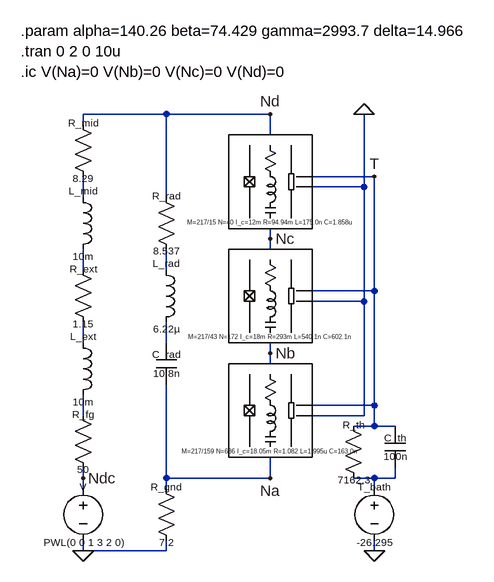
[diagram p0: schematic JPE_3stacks.asc]
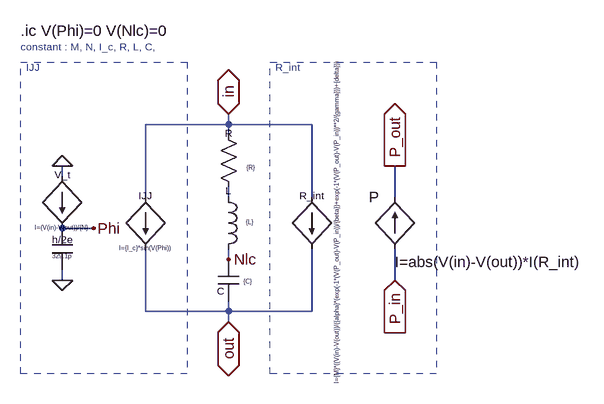
[diagram p1: sub-circuit 1stack.asc]
JPE_3stacks.asc, the LTspice schematic file:
Version 4
SHEET 1 1820 680
WIRE 544 -512 416 -512
WIRE 704 -512 544 -512
WIRE 416 -496 416 -512
WIRE 704 -480 704 -512
WIRE 864 -416 768 -416
WIRE 848 -400 848 -512
WIRE 848 -400 768 -400
WIRE 416 -384 416 -416
WIRE 544 -384 544 -512
WIRE 704 -320 704 -336
WIRE 704 -304 704 -320
WIRE 416 -272 416 -304
WIRE 544 -272 544 -304
WIRE 864 -240 864 -416
WIRE 864 -240 768 -240
WIRE 848 -224 848 -400
WIRE 848 -224 768 -224
WIRE 416 -160 416 -192
WIRE 544 -160 544 -192
WIRE 704 -144 704 -160
WIRE 704 -128 704 -144
WIRE 864 -64 864 -240
WIRE 864 -64 768 -64
WIRE 416 -48 416 -80
WIRE 848 -48 848 -224
WIRE 848 -48 768 -48
WIRE 864 -32 864 -64
WIRE 864 -32 832 -32
WIRE 896 -32 864 -32
WIRE 416 48 416 32
WIRE 544 48 544 -96
WIRE 704 48 704 16
WIRE 704 48 544 48
WIRE 864 48 832 48
WIRE 896 48 896 32
WIRE 896 48 864 48
WIRE 416 64 416 48
WIRE 544 64 544 48
WIRE 864 64 864 48
WIRE 416 160 416 144
WIRE 544 160 544 144
WIRE 544 160 416 160
WIRE 864 160 864 144
FLAG 416 160 0
FLAG 704 -144 Nb
FLAG 704 48 Na
FLAG 864 160 0
FLAG 864 -416 T
FLAG 848 -512 0
FLAG 704 -320 Nc
FLAG 704 -512 Nd
FLAG 416 48 Ndc
SYMBOL voltage 416 48 R0
WINDOW 0 0 24 Bottom 1
WINDOW 3 0 88 Top 1
SYMATTR InstName V
SYMATTR Value PWL(0 0 1 3 2 0)
SYMBOL res 400 -64 R0
WINDOW 0 16 24 Bottom 1
WINDOW 3 16 88 Top 1
SYMATTR InstName R_fg
SYMATTR Value 50
SYMBOL ind 400 -176 R0
WINDOW 0 16 16 Bottom 1
WINDOW 3 16 96 Top 1
SYMATTR InstName L_ext
SYMATTR Value 10m
SYMBOL res 400 -288 R0
WINDOW 0 16 24 Bottom 1
WINDOW 3 16 88 Top 1
SYMATTR InstName R_ext
SYMATTR Value 1.15
SYMBOL ind 400 -400 R0
WINDOW 0 16 16 Bottom 1
WINDOW 3 16 96 Top 1
SYMATTR InstName L_mid
SYMATTR Value 10m
SYMBOL ind 528 -288 R0
WINDOW 0 16 16 Bottom 1
WINDOW 3 16 96 Top 1
SYMATTR InstName L_rad
SYMATTR Value 6.22µ
SYMBOL res 528 -400 R0
WINDOW 0 16 24 Bottom 1
WINDOW 3 16 88 Top 1
SYMATTR InstName R_rad
SYMATTR Value 8.537
SYMBOL cap 528 -160 R0
WINDOW 0 16 28 Bottom 1
WINDOW 3 16 36 Top 1
SYMATTR InstName C_rad
SYMATTR Value 10.8n
SYMBOL res 528 48 R0
WINDOW 0 16 24 Bottom 1
WINDOW 3 16 88 Top 1
SYMATTR InstName R_gnd
SYMATTR Value 7.2
SYMBOL voltage 864 48 R0
WINDOW 0 0 24 Bottom 1
WINDOW 3 0 88 Top 1
SYMATTR InstName T_bath
SYMATTR Value -26.295
SYMBOL res 816 -48 R0
WINDOW 0 16 24 Bottom 1
WINDOW 3 16 88 Top 1
SYMATTR InstName R_th
SYMATTR Value 7162.3
SYMBOL cap 880 -32 R0
WINDOW 0 16 28 Bottom 1
WINDOW 3 16 36 Top 1
SYMATTR InstName C_th
SYMATTR Value 100n
SYMBOL res 400 -512 R0
WINDOW 0 16 24 Bottom 1
WINDOW 3 16 88 Top 1
SYMATTR InstName R_mid
SYMATTR Value 8.29
SYMBOL 1stack 704 -416 R0
WINDOW 0 0 -64 Invisible 1
WINDOW 39 0 64 Top 0
SYMATTR InstName X4
SYMATTR SpiceLine M=217/15 N=40 I_c=12m R=94.94m L=175.0n C=1.858u
SYMBOL 1stack 704 -240 R0
WINDOW 0 0 -64 Invisible 1
WINDOW 39 0 64 Top 0
SYMATTR InstName X5
SYMATTR SpiceLine M=217/43 N=172 I_c=18m R=293m L=540.1n C=602.1n
SYMBOL 1stack 704 -64 R0
WINDOW 0 0 -64 Invisible 1
WINDOW 39 0 64 Top 0
SYMATTR InstName X6
SYMATTR SpiceLine M=217/159 N=636 I_c=18.05m R=1.082 L=1.995u C=163.0n
TEXT 320 -640 Left 2 !.param alpha=140.26 beta=74.429 gamma=2993.7 delta=14.966\n.tran 0 2 0 10u\n.ic V(Na)=0 V(Nb)=0 V(Nc)=0 V(Nd)=0

1stack.asc, the sub-circuit schematic file:
Version 4
SHEET 1 880 680
WIRE 224 16 224 0
WIRE 224 16 96 16
WIRE 352 16 224 16
WIRE 224 32 224 16
WIRE -32 96 -32 80
WIRE 96 128 96 16
WIRE 224 128 224 112
WIRE 352 128 352 16
WIRE 480 128 480 80
WIRE 16 176 -32 176
WIRE 224 224 224 208
WIRE -32 256 -32 240
WIRE 480 256 480 208
WIRE 96 304 96 208
WIRE 224 304 224 288
WIRE 224 304 96 304
WIRE 352 304 352 208
WIRE 352 304 224 304
WIRE 224 320 224 304
FLAG 224 0 in
IOPIN 224 0 BiDir
FLAG 224 320 out
IOPIN 224 320 BiDir
FLAG 480 80 P_out
IOPIN 480 80 Out
FLAG 480 256 P_in
IOPIN 480 256 In
FLAG -32 80 0
FLAG -32 256 0
FLAG 16 176 Phi
FLAG 224 224 Nlc
SYMBOL bi 96 128 R0
WINDOW 0 0 8 Bottom 1
WINDOW 3 0 72 Top 0
SYMATTR InstName IJJ
SYMATTR Value I={I_c}*sin(V(Phi))
SYMBOL bi 352 128 R0
WINDOW 0 0 8 Bottom 1
WINDOW 3 32 32 VTop 0
SYMATTR InstName R_int
SYMATTR Value I={M}*((V(in)-V(out))/({alpha}*(exp(-1*(V(P_out)-V(P_in))/{beta})+exp(-1*(V(P_out)-V(P_in))**2/{gamma}))+{delta}))
SYMBOL res 208 16 R0
WINDOW 0 16 24 Bottom 1
WINDOW 3 51 60 Top 0
SYMATTR InstName R
SYMATTR Value {R}
SYMBOL cap 208 224 R0
WINDOW 0 4 38 Top 1
WINDOW 3 46 27 Top 0
SYMATTR InstName C
SYMATTR Value {C}
SYMBOL bi 480 208 R180
WINDOW 0 24 80 Left 2
WINDOW 3 -290 -20 Left 2
SYMATTR InstName P
SYMATTR Value I=abs(V(in)-V(out))*I(R_int)
SYMBOL bi -32 96 R0
WINDOW 0 0 8 Bottom 1
WINDOW 3 0 72 Top 0
SYMATTR InstName V_t
SYMATTR Value I=(V(in)-V(out))/{N}
SYMBOL cap -48 176 R0
WINDOW 0 16 28 Bottom 1
WINDOW 3 16 36 Top 0
SYMATTR InstName h/2e
SYMATTR Value 329.1p
SYMBOL ind 208 112 R0
WINDOW 0 16 16 Bottom 1
WINDOW 3 49 48 Top 0
SYMATTR InstName L
SYMATTR Value {L}
TEXT -96 -104 Left 1 ;constant : M, N, I_c, R, L, C,
TEXT -88 -72 Left 1 ;IJJ
TEXT 296 -72 Left 1 ;R_int
TEXT -96 -128 Left 2 !.ic V(Phi)=0 V(Nlc)=0
RECTANGLE Normal -96 -80 160 400 2
RECTANGLE Normal 544 400 288 -80 2

The netlist it stands for:
* JPE_3stacks.asc
V Ndc 0 PWL(0 0 1 3 2 0)
R_fg N006 Ndc 50
L_ext N004 N006 10m
R_ext N002 N004 1.15
L_mid N001 N002 10m
L_rad N003 N005 6.22µ
R_rad Nd N003 8.537
C_rad N005 Na 10.8n
R_gnd Na 0 7.2
V§T_bath N007 0 -26.295
R_th T N007 7162.3
C_th T N007 100n
R_mid Nd N001 8.29
XX4 Nd Nc T 0 1stack params: M=217/15 N=40 I_c=12m R=94.94m L=175.0n C=1.858u
XX5 Nc Nb T 0 1stack params: M=217/43 N=172 I_c=18m R=293m L=540.1n C=602.1n
XX6 Nb Na T 0 1stack params: M=217/159 N=636 I_c=18.05m R=1.082 L=1.995u C=163.0n

* block symbol definitions
.subckt 1stack in out P_out P_in
B§IJJ in out I={I_c}*sin(V(Phi))
B§R_int in out I={M}*((V(in)-V(out))/({alpha}*(exp(-1*(V(P_out)-V(P_in))/{beta})+exp(-1*(V(P_out)-V(P_in))**2/{gamma}))+{delta}))
R in N001 {R}
C Nlc out {C}
B§P P_in P_out I=abs(V(in)-V(out))*I(R_int)
B§V_t 0 Phi I=(V(in)-V(out))/{N}
C§h/2e Phi 0 329.1p
L N001 Nlc {L}
* constant : M, N, I_c, R, L, C,
* IJJ
* R_int
.ic V(Phi)=0 V(Nlc)=0
.ends 1stack

.param alpha=140.26 beta=74.429 gamma=2993.7 delta=14.966
.tran 0 2 0 10u
.ic V(Na)=0 V(Nb)=0 V(Nc)=0 V(Nd)=0
.backanno
.end